# Altium schematic sheet sensors.SchDoc
size 297 x 209 mm
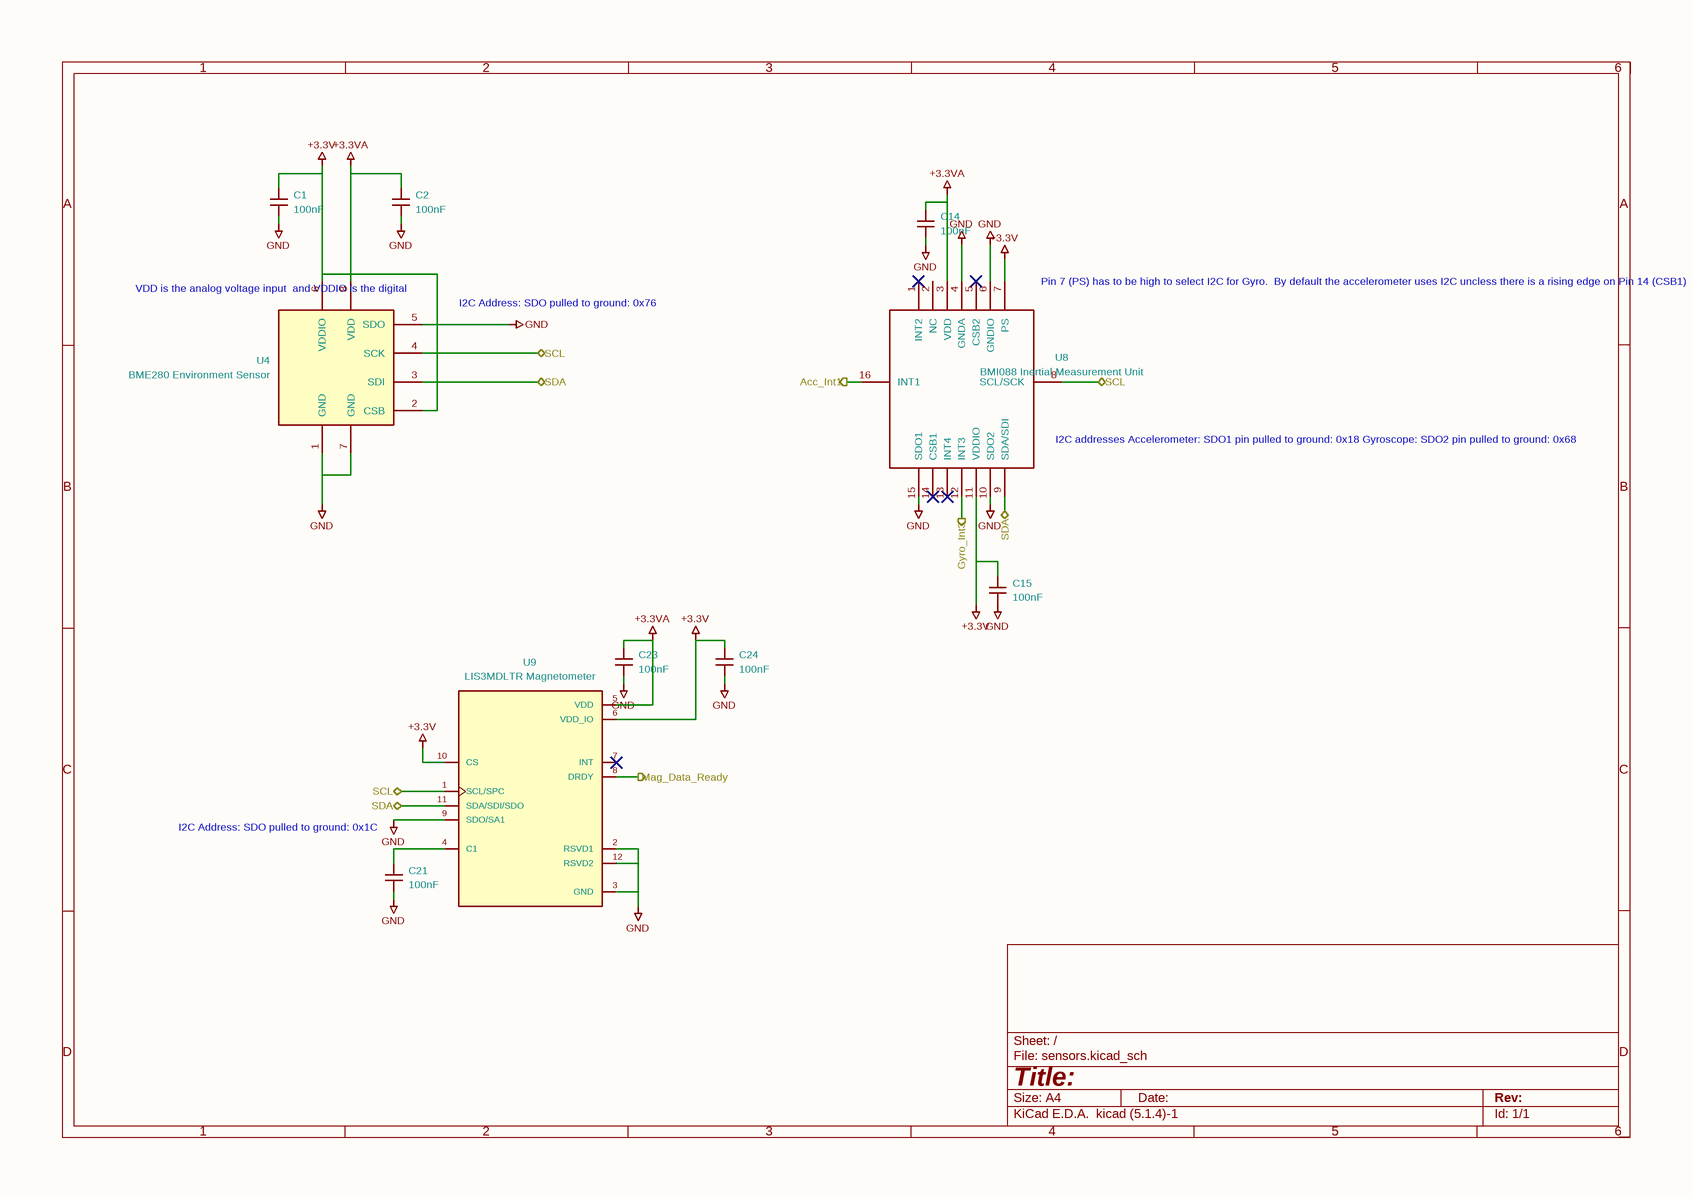
[diagram p0: sensors.SchDoc]

## Parts
C1  100nF  [C_0603_1608Metric]
C2  100nF  [C_0603_1608Metric]
C14  100nF  [C_0603_1608Metric]
C15  100nF  [C_0603_1608Metric]
C21  100nF  [C_0603_1608Metric]
C23  100nF  [C_0603_1608Metric]
C24  100nF  [C_0603_1608Metric]
U4  BME280 Environment Sensor  [Bosch_LGA-8_2.5x2.5mm_P0.65mm_ClockwisePinNumbering]
U8  BMI088 Inertial Measurement Unit  [BMI088]
U9  LIS3MDLTR Magnetometer  [XDCR_LIS3MDLTR]

## Ports
Acc_Int1 (out), Gyro_Int3 (out), Mag_Data_Ready (out), SCL (bidir), SDA (bidir)

## Nets
+3.3V: C1.1 C15.1 C24.1 U4.2(CSB) U4.6(VDDIO) U8.7(PS) U8.11(VDDIO) U9.6(VDD_IO) U9.10(CS)
+3.3VA: C2.1 C14.1 C23.1 U4.8(VDD) U8.3(VDD) U9.5(VDD)
GND: C1.2 C2.2 C14.2 C15.2 C21.2 C23.2 C24.2 U4.1(GND) U4.5(SDO) U4.7(GND) U8.4(GNDA) U8.6(GNDIO) U8.10(SDO2) U8.15(SDO1) U9.2(RSVD1) U9.3(GND) U9.9(SDO/SA1) U9.12(RSVD2)
Acc_Int1: U8.16(INT1) ; port Acc_Int1
Gyro_Int3: U8.12(INT3) ; port Gyro_Int3
Mag_Data_Ready: U9.8(DRDY) ; port Mag_Data_Ready
SCL: U4.4(SCK) U8.8(SCL/SCK) U9.1(SCL/SPC) ; port SCL
SDA: U4.3(SDI) U8.9(SDA/SDI) U9.11(SDA/SDI/SDO) ; port SDA
NetC21_1: C21.1 U9.4(C1)

Not connected (* = marked no-connect by the designer): U8 1(INT2)* 2(NC) 5(CSB2)* 13(INT4)* 14(CSB1)*; U9 7(INT)*

## Notes on the sheet
- (near U8) Pin 7 (PS) has to be high to select I2C for Gyro.
  By default the accelerometer uses I2C uncless there is a rising edge on Pin 14 (CSB1)
- (near U4) VDD is the analog voltage input
  and VDDIO is the digital
- I2C Address:
  SDO pulled to ground: 0x76
- (near U8) I2C addresses
  Accelerometer: SDO1 pin pulled to ground: 0x18
  Gyroscope: SDO2 pin pulled to ground: 0x68
- (near C21) I2C Address:
  SDO pulled to ground: 0x1C
- 1
- 2
- 3
- 4
- 5
- 6
- A
- B
- C
- D
- Title:
- File: sensors.kicad_sch
- Sheet: /
- KiCad E.D.A.  kicad (5.1.4)-1
- Size: A4
- Date:
- Rev:
- Id: 1/1

## Library data of the parts
C1 C2 C14 C15 C21 C23 C24 = C_0603: Value: 100nF; Footprint: Components:C_0603_1608Metric
U4 = BME280: Value: BME280 Environment Sensor; Footprint: Package_LGA:Bosch_LGA-8_2.5x2.5mm_P0.65mm_ClockwisePinNumbering
U8 = BMI088: Manufacturer_Name: BOSCH; Description: Inertial Measurement Unit Digital Output 2.5V/3.3V Automotive; Height: 1.45; Manufacturer_Part_Number: BMI088; Mouser Part Number: 262-BMI088; Mouser Price/Stock: https://www.mouser.co.uk/ProductDetail/Bosch-Sensortec/BMI088?qs=f9yNj16SXrIMFspTV6RB6Q%3D%3D; Arrow Part Number: BMI088; Arrow Price/Stock: https://www.arrow.com/en/products/bmi088/bosch?region=europe; Value: BMI088 Inertial Measurement Unit; Footprint: Components:BMI088
U9 = LIS3MDLTR: MF: STMicroelectronics; DESCRIPTION: LIS3MDL Series 3 Axis ±2/±8/±12/±16 g 3.6V High Performance Magnetometer LGA-12; PRICE: None; STANDARD: Manufacturer Recommendation; PARTREV: 6; MP: LIS3MDLTR; PACKAGE: VFLGA-12 STMicroelectronics; AVAILABILITY: Unavailable; MAXIMUM_PACKAGE_HEIGHT: 1mm; Value: LIS3MDLTR Magnetometer; Footprint: Components:XDCR_LIS3MDLTR